# Altium project ULN2003AN.PrjPcb
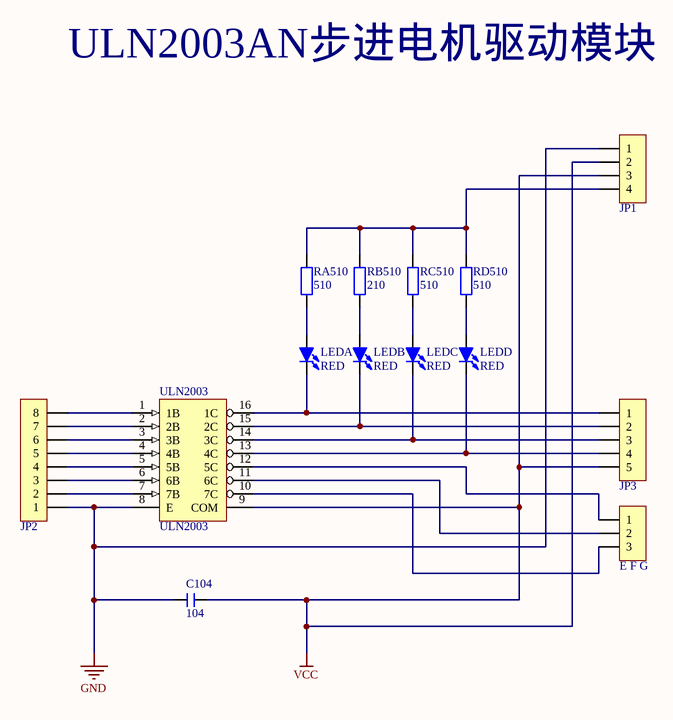
[diagram p0: DriveBoardSheet.SchDoc]
1 sheet, 14 parts. Net scope: global (net labels, ports and power ports of the same name join across sheets).
Board file: DriveBoardSheet.PcbDoc

## Sheet DriveBoardSheet.SchDoc
size A4; SheetNumber: 1; SheetTotal: 1

### Parts
C104  104  [MLCC5.08-A]
E_F_G  HDR-1X3  [HDR-1X3]  (value not drawn)
JP1  HDR-1X4  [HDR-1X4-ULN2003-VCC]  (value not drawn)
JP2  HDR-1X8  [HDR-1X8-ULN2003-IN]  (value not drawn)
JP3  HDR-1X5  [XH2.54-5P]  (value not drawn)
LEDA  RED  [LED 5MM-R]
LEDB  RED  [LED 5MM-R]
LEDC  RED  [LED 5MM-R]
LEDD  RED  [LED 5MM-R]
RA510  510  [RS 1/4W]
RB510  210  [RS 1/4W]
RC510  510  [RS 1/4W]
RD510  510  [RS 1/4W]
ULN2003  ULN2003  [DIP16-300]

### Nets
GND: C104.1 JP1.1 JP2.1 ULN2003.8(E)
VCC: C104.2 JP1.2 JP1.3 JP3.5 ULN2003.9(COM)
NetE_F_G_1: E_F_G.1 ULN2003.12(5C)
NetE_F_G_2: E_F_G.2 ULN2003.11(6C)
NetE_F_G_3: E_F_G.3 ULN2003.10(7C)
NetJP1_4: JP1.4 RA510.2 RB510.2 RC510.2 RD510.2
NetJP2_2: JP2.2 ULN2003.7(7B)
NetJP2_3: JP2.3 ULN2003.6(6B)
NetJP2_4: JP2.4 ULN2003.5(5B)
NetJP2_5: JP2.5 ULN2003.4(4B)
NetJP2_6: JP2.6 ULN2003.3(3B)
NetJP2_7: JP2.7 ULN2003.2(2B)
NetJP2_8: JP2.8 ULN2003.1(1B)
NetJP3_1: JP3.1 LEDA.2(K) ULN2003.16(1C)
NetJP3_2: JP3.2 LEDB.2(K) ULN2003.15(2C)
NetJP3_3: JP3.3 LEDC.2(K) ULN2003.14(3C)
NetJP3_4: JP3.4 LEDD.2(K) ULN2003.13(4C)
NetLEDA_1: LEDA.1(A) RA510.1
NetLEDB_1: LEDB.1(A) RB510.1
NetLEDC_1: LEDC.1(A) RC510.1
NetLEDD_1: LEDD.1(A) RD510.1

### Notes on the sheet
- ULN2003AN步进电机驱动模块

### Library data of the parts
C104 = C-MLCC: 独石电容; 版权归属: 源创客; BOM名称: 独石电容; 学习资源: www.ooocke.com
E_F_G = Header 3: 3P接插件; 版权归属: 源创客; BOM名称: 3P接插件; 学习资源: www.ooocke.com
JP1 = Header 4: 4P接插件; 版权归属: 源创客; BOM名称: 4P接插件; 学习资源: www.ooocke.com
JP2 = Header 8_ULN2003AN_IN: 8P接插件; 版权归属: 源创客; BOM名称: 8P接插件; 学习资源: www.ooocke.com
JP3 = Header 5: 5P接插件; 版权归属: 源创客; BOM名称: 5P接插件; 学习资源: www.ooocke.com
LEDA LEDB LEDC LEDD = LED-5MM: 5mm插件LED; 版权归属: 源创客; BOM名称: 5mm插件LED; 学习资源: www.ooocke.com
RA510 RB510 RC510 RD510 = R-CRR: 直插色环电阻; BOM名称: 色环电阻; 版权归属: 源创客; 学习资源: www.ooocke.com
ULN2003 = ULN2003-2: 达林顿驱动芯片; 版权归属: 源创客; BOM名称: 达林顿驱动芯片; 学习资源: www.ooocke.com